# Altium project hexbot_电源.PrjPcb
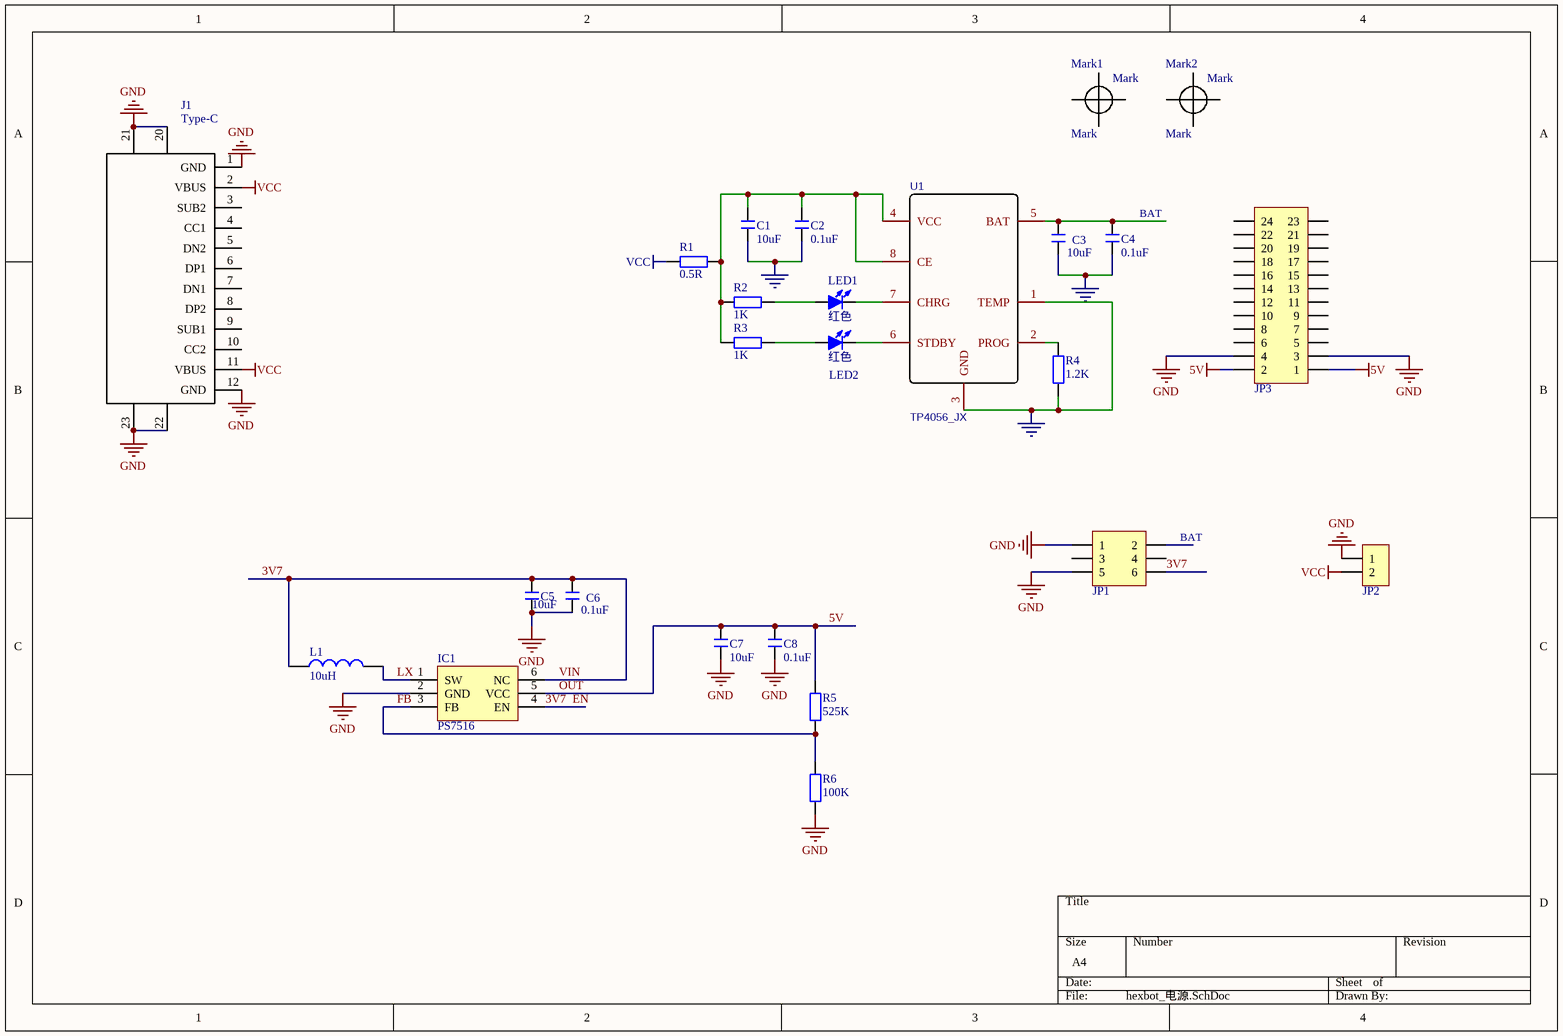
[diagram p0: hexbot_电源.SchDoc]
1 sheet, 25 parts. Net scope: global (net labels, ports and power ports of the same name join across sheets).
Board file: Hexbot_电源.PcbDoc

## Sheet hexbot_电源.SchDoc
size A4

### Parts
C1  10uF  [C 0603_L]
C2  0.1uF  [C 0603_L]
C3  10uF  [C 0603_L]
C4  0.1uF  [C 0603_L]
C5  10uF  [C 0603_L]
C6  0.1uF  [C 0603_L]
C7  10uF  [C 0603_L]
C8  0.1uF  [C 0603_L]
IC1  PS7516  [SOT23-6L]
J1  Type-C  [Type-C-16]
JP1  Header3X2  [HDR2.54-LI-2x3P]  (value not drawn)
JP2  HDR-1X2  [HDR2.54-LI-2P]  (value not drawn)
JP3  Header 2X11  [HDR2.54-WI-2x12P]  (value not drawn)
L1  10uH  [L 0603]
LED1  红色  [LED 0603R]
LED2  红色  [LED 0603R]
Mark1  Mark  [Mark]  (no BOM)
Mark2  Mark  [Mark]  (no BOM)
R1  0.5R  [R 0603_L]
R2  1K  [R 0603_L]
R3  1K  [R 0603_L]
R4  1.2K  [R 0603_L]
R5  525K  [R 0805_L]
R6  100K  [R 0805_L]
U1  TP4056_JX  [TP4056]

### Nets
5V: C7.2 C8.2 IC1.5(VCC) JP3.1 JP3.2 R5.2  [also labelled OUT]
GND: C1.1 C2.1 C3.1 C4.1 C5.1 C6.1 C7.1 C8.1 IC1.2(GND) J1.1(GND) J1.12(GND) J1.20 J1.21 J1.22 J1.23 JP1.1 JP1.5 JP2.1 JP3.3 JP3.4 R4.1 R6.1 U1.1(TEMP) U1.3(GND)
VCC: J1.2(VBUS) J1.11(VBUS) JP2.2 R1.1
3V7: C5.2 C6.2 IC1.4(EN) IC1.6(NC) JP1.6 L1.1  [also labelled EN, VIN]
BAT: C3.2 C4.2 JP1.2 U1.5(BAT)
FB: IC1.3(FB) R5.1 R6.2
LX: IC1.1(SW) L1.2
NetC1_2: C1.2 C2.2 R1.2 R2.1 R3.1 U1.4(VCC) U1.8(CE)
NetLED1_1: LED1.1(A) R2.2
NetLED1_2: LED1.2(K) U1.7(CHRG)
NetLED2_1: LED2.1(A) R3.2
NetLED2_2: LED2.2(K) U1.6(STDBY)
NetR4_2: R4.2 U1.2(PROG)

Not connected (* = marked no-connect by the designer): J1 3(SUB2) 4(CC1) 5(DN2) 6(DP1) 7(DN1) 8(DP2) 9(SUB1) 10(CC2); JP1 3 4; JP3 5 6 7 8 9 10 11 12 13 14 15 16 17 18 19 20 21 22 23 24

### Library data of the parts
C1-C8 = C: 贴片电容; BOM名称: 无极性贴片电容; 淘宝ID: 封装库来自淘宝 ID：黄晶宝石; 联系售后，技术支持: https://shop463601444.taobao.com; 唯一出售店铺网址: https://shop463601444.taobao.com
IC1 = SX1308: 可调升压芯片; 版权归属: 封装库来自淘宝 ID：黄晶宝石; BOM名称: 可调升压芯片; 学习资源: www.ooocke.com
J1 = Type-C-16pin
JP1 = Header 3X2: 3*2P接插件; 版权归属: 封装库来自淘宝 ID：黄晶宝石; BOM名称: 3*2P接插件; 学习资源: https://shop463601444.taobao.com
JP2 = Header 2: 2P接插件; 版权归属: 封装库来自淘宝 ID：黄晶宝石; BOM名称: 2P接插件; 联系售后: https://shop463601444.taobao.com
JP3 = Header 12X2: 12*2P接插件; 版权归属: 封装库来自淘宝卖家 ID：黄晶宝石; BOM名称: 12*2P接插件; 学习资源: https://shop463601444.taobao.com
L1 = L: 小功率贴片电感; 淘宝ID: 封装库来自淘宝 ID：黄晶宝石; 封装库来自淘宝卖家 ID：黄晶宝石: 其他店铺购入均为盗版，不享受售后技术支持服务，请立即申请退款; BOM名称: 小功率贴片电感; 联系售后: https://shop463601444.taobao.com
LED1 LED2 = LED-SMD: 贴片LED; 版权归属: 封装库来自淘宝 ID：黄晶宝石; BOM名称: 贴片LED; 学习资源: https://shop463601444.taobao.com
R1-R6 = R: 贴片电阻; 版权归属: 来自淘宝 ID：黄晶宝石; 封装库来自淘宝卖家 ID：黄晶宝石: 其他店铺购入均为盗版，不享受售后技术支持服务，请立即申请退款; BOM名称: 贴片电阻; 联系售后: https://shop463601444.taobao.com
U1 = TP4056_JX: BOM_Supplier: LCSC; spicePre: U